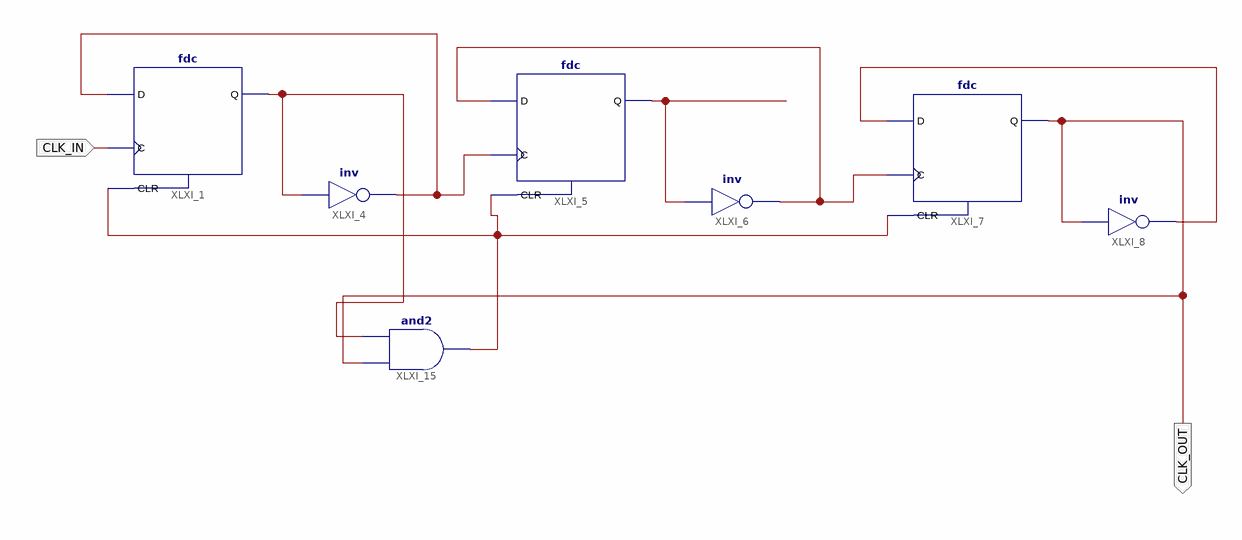
[diagram p0: schematic sheet 1]
// Xilinx ISE schematic div5.sch (spartan6) as structural Verilog: 7 symbols, 2 ports
module div5 (
  input  CLK_IN,
  output CLK_OUT
);

  wire XLXN_2, XLXN_8, XLXN_9, XLXN_10, XLXN_12, XLXN_17;

  not XLXI_4 (XLXN_8, XLXN_12);
  fdc XLXI_1 (.C(CLK_IN), .CLR(XLXN_17), .D(XLXN_8), .Q(XLXN_12));
  fdc XLXI_5 (.C(XLXN_8), .CLR(XLXN_17), .D(XLXN_9), .Q(XLXN_2));
  not XLXI_6 (XLXN_9, XLXN_2);
  fdc XLXI_7 (.C(XLXN_9), .CLR(XLXN_17), .D(XLXN_10), .Q(CLK_OUT));
  not XLXI_8 (XLXN_10, CLK_OUT);
  and XLXI_15 (XLXN_17, CLK_OUT, XLXN_12);
endmodule
